# Altium schematic sheet Regulators.SchDoc
size A4; DocumentNumber: 3; SheetNumber: 3; SheetTotal: 8
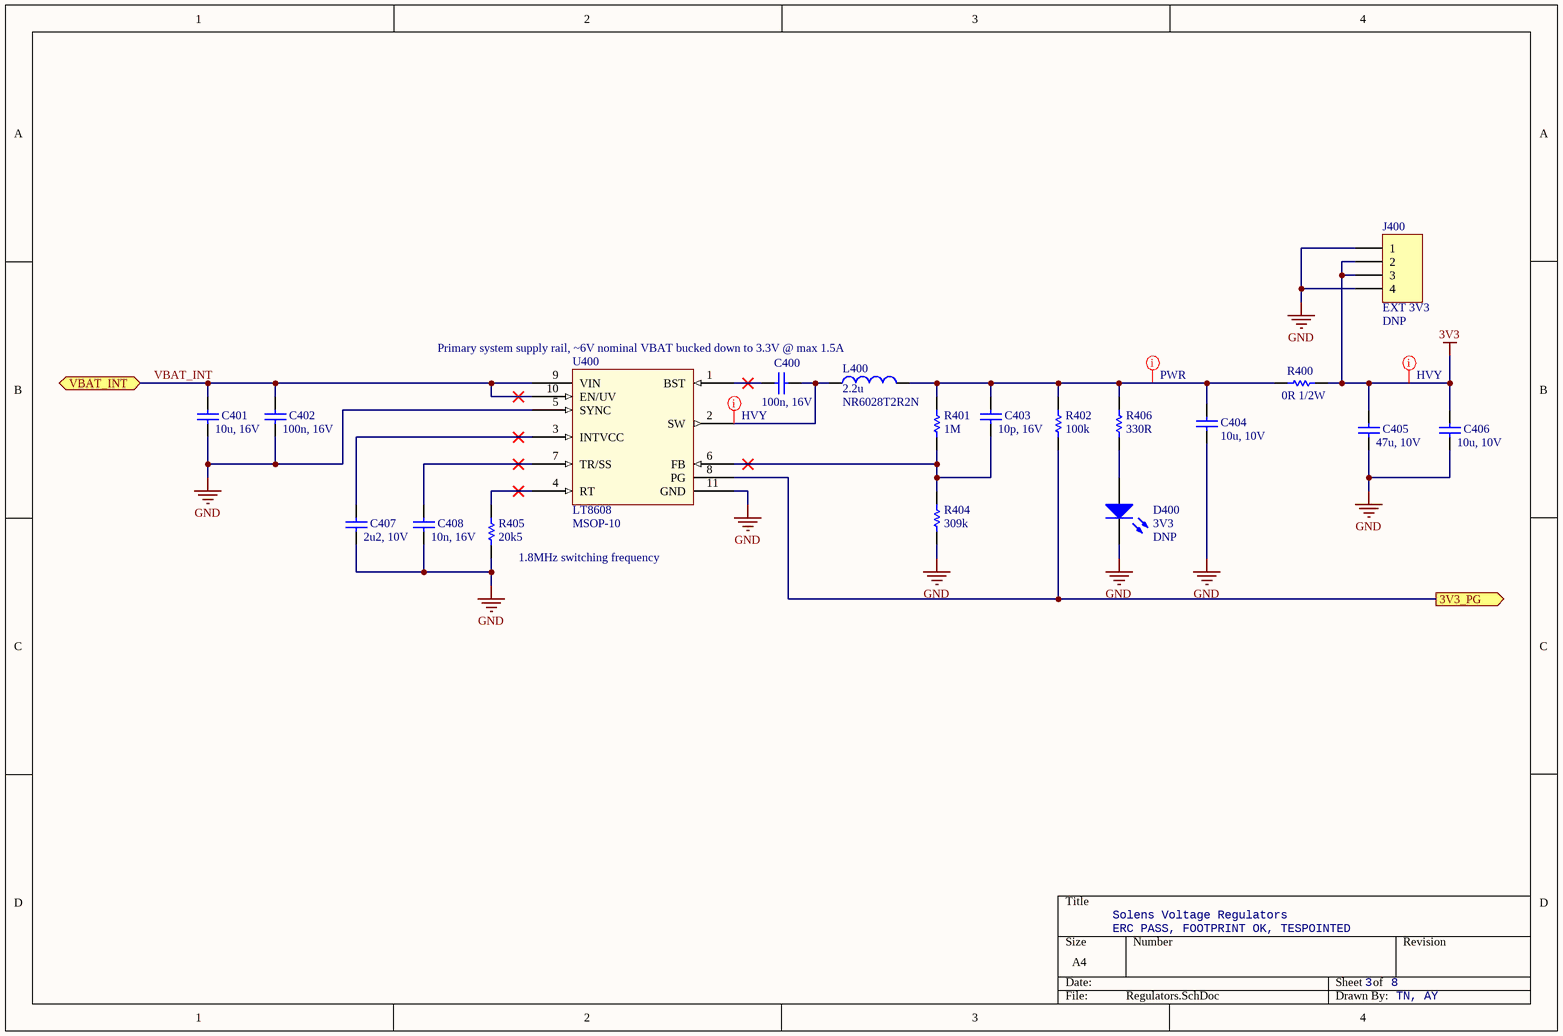
[diagram p0: Regulators.SchDoc]

## Parts
C400  value 100n, 16V  [CAP_0402]  (hidden comment: 100n, 16V, 0402)
C401  value 10u, 16V  [CAP_1206]  (hidden comment: 10u, 16V, 1206)
C402  value 100n, 16V  [CAP_0402]  (hidden comment: 100n, 16V, 0402)
C403  value 10p, 16V  [CAP_0805]  (hidden comment: 10p, 16V, 0805)
C404  value 10u, 10V  [CAP_0805]  (hidden comment: 10u, 10V, 0805)
C405  value 47u, 10V  [CAP_1206]  (hidden comment: 47u, 10V, 1206)
C406  value 10u, 10V  [CAP_0805]  (hidden comment: 10u, 10V, 0805)
C407  value 2u2, 10V  [CAP_0805]  (hidden comment: 2u2, 10V, 0805)
C408  value 10n, 16V  [CAP_0805]  (hidden comment: 10n, 16V, 0805)
D400  Function: 3V3  [LED_0603]  (hidden comment: LED, RED, 0603 (DNP))
J400  Function: EXT 3V3  [HDR1X4]  (hidden comment: HDR_1x4_100TH_THT (DNP))
L400  value 2.2u  [IND_TAIYO_NR6028]  (hidden comment: NR6028T2R2N)
R400  value 0R 1/2W  [RES_1206]  (hidden comment: 0R, 1/2W, 1206)
R401  value 1M  [RES_0805]  (hidden comment: 1M, 1/8W, 0805)
R402  value 100k  [RES_0805]  (hidden comment: 100k, 1/8W, 0805)
R404  value 309k  [RES_0805]  (hidden comment: 309k, 1/8W, 0805)
R405  value 20k5  [RES_0805]  (hidden comment: 20k5, 1/8W, 0805)
R406  value 330R  [RES_0805]  (hidden comment: 330, 1/8W, 0805)
U400  PackageName: MSOP-10  [TSSOP50P490X110_HS-11N]  (hidden comment: LT8608, MSOP-10)

## Ports
3V3_PG (out), VBAT_INT

## Nets
3V3: C405.1 C406.2 J400.2 J400.3 R400.1
GND: C401.2 C402.2 C404.1 C405.2 C406.1 C407.2 C408.2 D400.2(K) J400.1 J400.4 R404.1 R405.2 U400.5(SYNC) U400.11(GND)
3V3_PG: R402.1 U400.8(PG) ; port 3V3_PG
VBAT_INT: C401.1 C402.1 U400.9(VIN) U400.10(EN/UV) ; port VBAT_INT
NetC400_1: C400.1 U400.1(BST)
NetC400_2: C400.2 L400.1 U400.2(SW)
NetC403_1: C403.1 R401.1 R404.2 U400.6(FB)
NetC403_2: C403.2 C404.2 L400.2 R400.2 R401.2 R402.2 R406.2
NetC407_1: C407.1 U400.3(INTVCC)
NetC408_1: C408.1 U400.7(TR/SS)
NetD400_1: D400.1(A) R406.1
NetR405_1: R405.1 U400.4(RT)

## Layout directives
net class PWR: NetC403_2
net class HVY: 3V3, NetC400_2

## Notes on the sheet
- Primary system supply rail, ~6V nominal VBAT bucked down to 3.3V @ max 1.5A
- (near R405) 1.8MHz switching frequency
- Solens Voltage Regulators
- ERC PASS, FOOTPRINT OK, TESPOINTED
- TN, AY

## Library data of the parts
C400-C408 = Cap: Capacitor
  C400 C402: DigikeyPN: 587-3498-1-ND
  C401: DigikeyPN: 1276-1312-1-ND
  C403: DigikeyPN: 1276-1109-1-ND
  C404 C406: DigikeyPN: 1276-6455-1-ND
  C405: DigikeyPN: 1276-3063-1-ND
  C407: DigikeyPN: 1276-6458-1-ND
  C408: DigikeyPN: 1276-1015-1-ND
D400 = LED0: DigikeyPN: 732-4978-1-ND; DNP: DNP; Value: LED, RED
J400 = Header 4: Header, 4-Pin; DigikeyPN: 732-5317-ND; DNP: DNP; Value: HDR_1x4_100TH_THT
L400 = Inductor: PartNumber: NR6028T2R2N; DigikeyPN: 587-2098-1-ND
R400-R402 R404-R406 = Res1: Resistor
  R400: DigikeyPN: 36-5106CT-ND
  R401: DigikeyPN: 311-1.00MCRCT-ND
  R402: DigikeyPN: 311-100KCRCT-ND
  R404: DigikeyPN: 311-309KCRCT-ND
  R405: DigikeyPN: 311-20.5KCRCT-ND
  R406: DigikeyPN: 311-330CRCT-ND
U400 = LT8608: 42V 1.5A step-down, low Iq; PartNumber: LT8608; DigikeyPN: LT8608IMSE#PBF-ND; Value: LT8608